# EAGLE design ESP-32-UNICLOCK-Z560M-V2 (EAGLE 6.3)
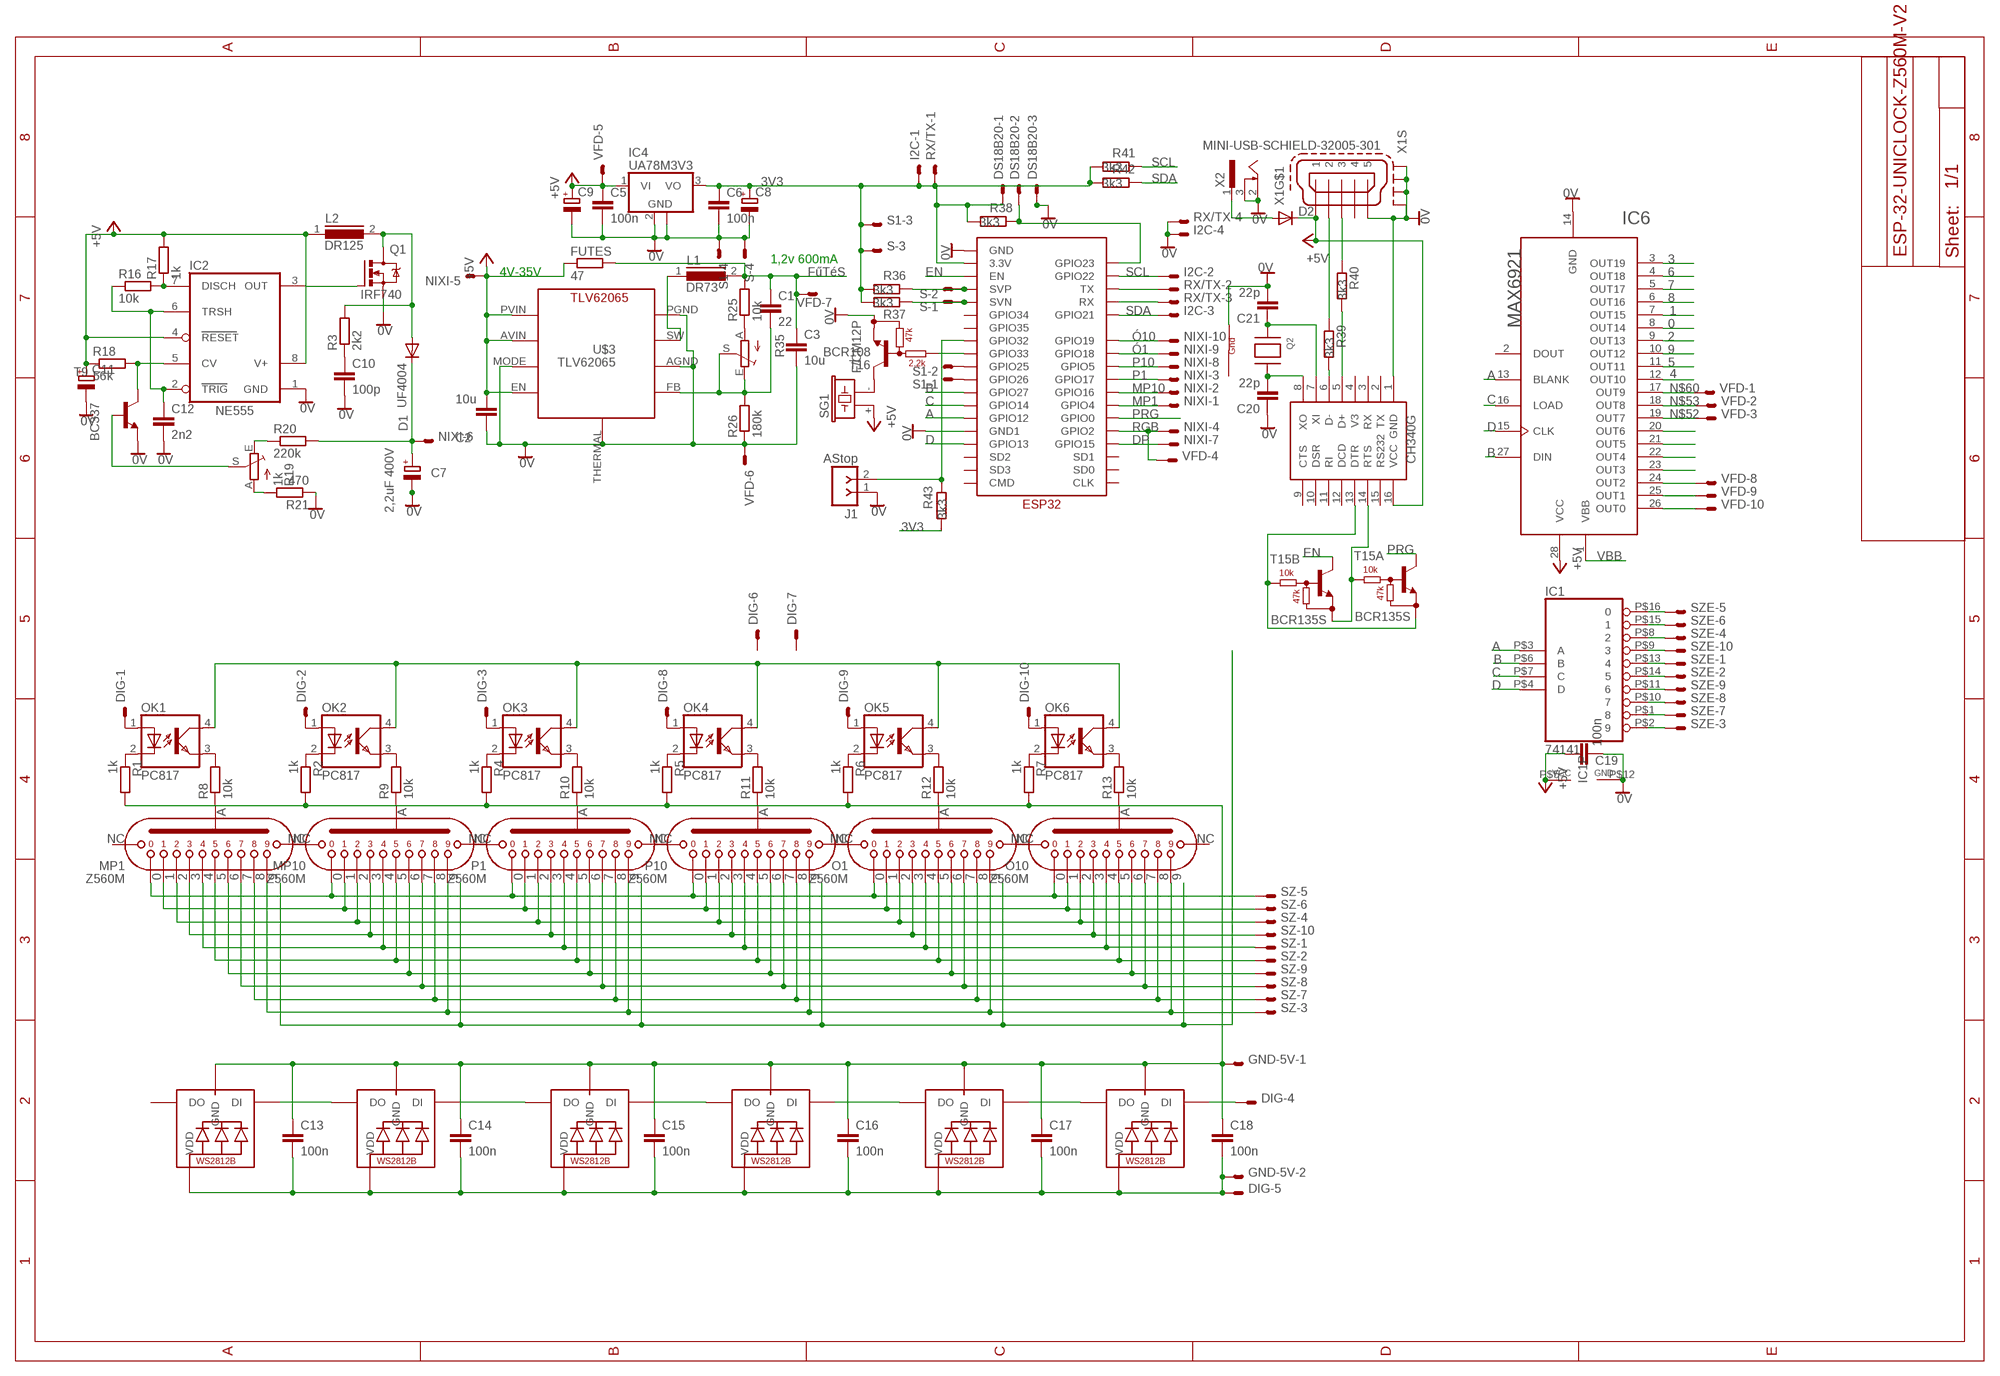
[diagram p0: schematic, sheet 1]

## Parts
C1  22  C0603  [0603]
C2  10u  C1206  [1206]
C3  10u  C1206  [1206]
C5  100n  C0603  [0603]
C6  100n  C0603  [0603]
C7  2,2uF 400V  CPOL-EUE2.5-7  [E2,5-7]
C8  CPOL-EUE2.5-5  [E2,5-5]
C9  CPOL-EUE2.5-5  [E2,5-5]
C10  100p  C-EU050-024X044  [C050-024X044]
C11  CPOL-EUE2.5-7  [E2,5-7]
C12  2n2  C-EUC0603  [C0603]
C13  100n  C-EUC0603  [C0603]
C14  100n  C-EUC0603  [C0603]
C15  100n  C-EUC0603  [C0603]
C16  100n  C-EUC0603  [C0603]
C17  100n  C-EUC0603  [C0603]
C18  100n  C-EUC0603  [C0603]
C19  100n  C0603  [0603]
C20  22p  C0603  [0603]
C21  22p  C0603  [0603]
D1  UF4004  BA221  [DO35-10]
D2  DIODE-SOD123  [SOD123]
DIG  DIG  PAD10  [PAD10]
DS18B20  PAD3  [PAD3]
FUTES  47  R-EU_0207/10  [0207/10]
GND-5V  PAD2  [PAD2]
I2C  PAD4  [PAD4]
IC1  74141  [DIL16SMD]
IC2  NE555  ICM7555  [DIL08]
IC4  UA78M3V3  UA78M05DCY  [SOT223]
IC6  MAX6921  MAX6921SOIC28W  [SO-28W]
J1  AStop  F-1X02-SIP-100-32  [SIP-100-02-32]
L1  DR73  [DR73]
L2  DR125  [DR125]
LED1  WS2812B_5050N  [WS2812B-NARROW]
LED2  WS2812B_5050N  [WS2812B-NARROW]
LED3  WS2812B_5050N  [WS2812B-NARROW]
LED4  WS2812B_5050N  [WS2812B-NARROW]
LED5  WS2812B_5050N  [WS2812B-NARROW]
LED6  WS2812B_5050N  [WS2812B-NARROW]
MP1  Z560M  [Z560M]
MP10  Z560M  [Z560M]
NIXI  PAD10  [PAD10]
O1  Z560M  [Z560M]
O10  Z560M  [Z560M]
OK1  PC817  [DIL04]
OK2  PC817  [DIL04]
OK3  PC817  [DIL04]
OK4  PC817  [DIL04]
OK5  PC817  [DIL04]
OK6  PC817  [DIL04]
P1  Z560M  [Z560M]
P10  Z560M  [Z560M]
Q1  IRF740  [TO220BV]
Q2  XTAL-4-3225  [NX3225]
R1  1k  R0603  [0603]
R2  1k  R0603  [0603]
R3  2k2  R-EU_0204/7  [0204/7]
R4  1k  R0603  [0603]
R5  1k  R0603  [0603]
R6  1k  R0603  [0603]
R7  1k  R0603  [0603]
R8  10k  R-EU_0207/10  [0207/10]
R9  10k  R-EU_0207/10  [0207/10]
R10  10k  R-EU_0207/10  [0207/10]
R11  10k  R-EU_0207/10  [0207/10]
R12  10k  R-EU_0207/10  [0207/10]
R13  10k  R-EU_0207/10  [0207/10]
R16  10k  R-EU_R0603  [R0603]
R17  1k  R-EU_R0603  [R0603]
R18  56k  R-EU_R0603  [R0603]
R19  1k  TRIM_EU-CA6H  [CA6H]
R20  220k  R-EU_0204/7  [0204/7]
R21  470  R-EU_0204/7  [0204/7]
R25  10k  R0603  [0603]
R26  180k  R0603  [0603]
R35  TRIM_EU-B25P  [B25P]
R36  3k3  R0603  [0603]
R37  3k3  R0603  [0603]
R38  3k3  R0603  [0603]
R39  3k3  R0603  [0603]
R40  3k3  R0603  [0603]
R41  3k3  R0603  [0603]
R42  3k3  R0603  [0603]
R43  3k3  R0603  [0603]
RX/TX  PAD4  [PAD4]
S  PAD4  [PAD4]
S1  PAD4  [PAD4]
SG1  F/CM12P  [F/CM12P]
SZ  PAD10  [PAD10]
SZE  PAD10  [PAD10]
T9  BC337  BC237-NPN-TO92-CBE  [TO92-CBE]
T15  BCR135S  [SOT363_INFINEON]
T16  BCR108  [SOT23-BEC]
U$1  CH340G  [SOIC16]
U$2  ESP32-2X18  [ESP322X18]
U$3  TLV62065  [TLV62065]
VFD  PAD10  [PAD10]
X1  MINI-USB-SCHIELD-32005-301  [32005-301]
X2  733989-5  [733989-5]

## Nets
0: IC1.P$16 IC6.8(OUT14) SZE.P$5
0V: C2.2 C3.2 C5.2 C6.2 C7.- C8.- C9.- C10.2 C11.- C12.2 C19.2 C20.1 C21.2 DS18B20.P$3 I2C.P$4 IC1.P$12(GND) IC2.1(GND) IC4.2(GND) IC4.4(GND) IC6.14(GND) J1.1 Q1.S Q2.4(G1) R21.1 R26.1 RX/TX.P$4 S1.P$4 S.P$4 T9.E T16.E U$1.1(GND) U$2.P$19(GND) U$2.P$26(GND1) U$3.AGND U$3.MODE U$3.PGND U$3.THERMAL VFD.P$6 X1.5 X1.M1(S:S1) X1.M2(S:S2) X1.M3(S:S3) X1.M4(S:S4) X2.2 X2.3
1: IC1.P$15 IC6.7(OUT15) SZE.P$6
2: IC1.P$8 IC6.9(OUT13) SZE.P$4
3: IC1.P$9 IC6.3(OUT19) SZE.P$10
3V3: C6.1 C8.+ DS18B20.P$1 I2C.P$1 IC4.3(VO) R36.2 R37.2 R38.2 R41.2 R42.2 R43.2 RX/TX.P$1 S1.P$3 S.P$3 U$2.P$20(3.3V)
4: IC1.P$13 IC6.12(OUT10) SZE.P$1
5: IC1.P$14 IC6.11(OUT11) SZE.P$2
6: IC1.P$11 IC6.4(OUT18) SZE.P$9
7: IC1.P$10 IC6.5(OUT17) SZE.P$8
8: IC1.P$1 IC6.6(OUT16) SZE.P$7
9: IC1.P$2 IC6.10(OUT12) SZE.P$3
+5V: C2.1 C5.1 C9.+ C11.+ C19.1 D2.C FUTES.1 IC1.P$5(VCC) IC2.4(RESET) IC2.8(V+) IC4.1(VI) IC6.28(VCC) L2.1 NIXI.P$5 R17.2 R18.1 SG1.+ U$1.16(VCC) U$3.AVIN U$3.EN U$3.PVIN VFD.P$5 X1.1
A: IC1.P$3(A) IC6.13(BLANK) U$2.P$12(GPIO12)
B: IC1.P$6(B) IC6.27(DIN) U$2.P$10(GPIO27)
C: IC1.P$7(C) IC6.16(LOAD) U$2.P$9(GPIO14)
D: IC1.P$4(D) IC6.15(CLK) U$2.P$11(GPIO13)
DP: NIXI.P$7 U$2.P$35(GPIO15)
EN: T15.3(B:C) U$2.P$21(EN)
FűTéS: C1.1 C3.1 FUTES.2 L1.2 R25.2 VFD.P$7
GND: C13.1 C14.1 C15.1 C16.1 C17.1 C18.1 GND-5V.P$1 LED1.3-GND(GND) LED2.3-GND(GND) LED3.3-GND(GND) LED4.3-GND(GND) LED5.3-GND(GND) LED6.3-GND(GND) R1.2 R2.2 R4.2 R5.2 R6.2 R7.2
K0: MP1.P3 MP10.P3 O1.P3 O10.P3 P1.P3 P10.P3 SZ.P$5
K1: MP1.P13 MP10.P13 O1.P13 O10.P13 P1.P13 P10.P13 SZ.P$6
K2: MP1.P12 MP10.P12 O1.P12 O10.P12 P1.P12 P10.P12 SZ.P$4
K3: MP1.P11 MP10.P11 O1.P11 O10.P11 P1.P11 P10.P11 SZ.P$10
K4: MP1.P10 MP10.P10 O1.P10 O10.P10 P1.P10 P10.P10 SZ.P$1
K5: MP1.P9 MP10.P9 O1.P9 O10.P9 P1.P9 P10.P9 SZ.P$2
K6: MP1.P7 MP10.P7 O1.P7 O10.P7 P1.P7 P10.P7 SZ.P$9
K7: MP1.P6 MP10.P6 O1.P6 O10.P6 P1.P6 P10.P6 SZ.P$8
K8: MP1.P5 MP10.P5 O1.P5 O10.P5 P1.P5 P10.P5 SZ.P$7
K9: MP1.P4 MP10.P4 O1.P4 O10.P4 P1.P4 P10.P4 SZ.P$3
MP1: NIXI.P$1 U$2.P$34(GPIO4)
MP10: NIXI.P$2 U$2.P$31(GPIO16)
N$1: T15.1(A:E) T15.5(B:B) U$1.13(DTR)
N$2: S1.P$1 U$2.P$7(GPIO26)
N$3: IC6.26(OUT0) VFD.P$10
N$4: IC6.25(OUT1) VFD.P$9
N$6: L1.1 U$3.SW
N$7: OK1.2(C) R1.1
N$8: IC6.24(OUT2) VFD.P$8
N$10: OK2.2(C) R2.1
N$11: OK3.2(C) R4.1
N$12: OK6.2(C) R7.1
N$13: DIG.P$10 OK6.1(A)
N$14: DIG.P$3 OK3.1(A)
N$15: OK1.4(COL) OK2.4(COL) OK3.4(COL) OK4.4(COL) OK5.4(COL) OK6.4(COL)
N$16: DIG.P$1 OK1.1(A)
N$17: OK4.2(C) R5.1
N$18: R19.E R20.1
N$19: DIG.P$8 OK4.1(A)
N$20: R19.A R21.2
N$21: OK5.2(C) R6.1
N$22: IC2.3(OUT) Q1.G
N$23: IC2.7(DISCH) R16.2 R17.1
N$24: C12.1 IC2.2(TRIG) IC2.6(TRSH) R16.1
N$25: DIG.P$9 OK5.1(A)
N$26: IC2.5(CV) R18.2 T9.C
N$27: C10.1 R3.1
N$28: R37.1 S.P$1 U$2.P$1(SVN)
N$29: DIG.P$2 OK2.1(A)
N$30: MP1.P2(A) R8.1
N$31: MP10.P2(A) R9.1
N$32: P1.P2(A) R10.1
N$33: P10.P2(A) R11.1
N$34: O1.P2(A) R12.1
N$35: O10.P2(A) R13.1
N$36: OK6.3(EMIT) R13.2
N$37: OK5.3(EMIT) R12.2
N$38: OK4.3(EMIT) R11.2
N$39: OK3.3(EMIT) R10.2
N$40: OK2.3(EMIT) R9.2
N$41: OK1.3(EMIT) R8.2
N$43: IC6.23(OUT3)
N$44: D1.A L2.2 Q1.D R3.2
N$46: DS18B20.P$2 R38.1 U$2.P$23(GPIO23)
N$49: IC6.22(OUT4)
N$50: IC6.21(OUT5)
N$51: IC6.20(OUT6)
N$52: IC6.19(OUT7) VFD.P$3
N$53: IC6.18(OUT8) VFD.P$2
N$54: LED1.2-DOUT(DO) LED2.4-DIN(DI)
N$55: LED2.2-DOUT(DO) LED3.4-DIN(DI)
N$60: IC6.17(OUT9) VFD.P$1
N$65: LED3.2-DOUT(DO) LED4.4-DIN(DI)
N$66: LED4.2-DOUT(DO) LED5.4-DIN(DI)
N$70: D2.A X2.1
N$71: DIG.P$4 LED1.4-DIN(DI)
N$72: R36.1 S.P$2 U$2.P$2(SVP)
N$73: S1.P$2 U$2.P$8(GPIO25)
N$74: R39.1 X1.2
N$75: R40.2 U$1.5(D+)
N$76: R39.2 U$1.6(D-)
N$77: R40.1 X1.3
N$78: LED5.2-DOUT(DO) LED6.4-DIN(DI)
N$79: T15.2(A:B) T15.4(B:E) U$1.14(RTS)
N$80: C20.2 Q2.3(X2) U$1.8(XO)
N$81: C13.2 C14.2 C15.2 C16.2 C17.2 C18.2 DIG.P$5 GND-5V.P$2 LED1.1-VDD(VDD) LED2.1-VDD(VDD) LED3.1-VDD(VDD) LED4.1-VDD(VDD) LED5.1-VDD(VDD) LED6.1-VDD(VDD)
N$89: C21.1 Q2.1(X1) U$1.7(XI)
N$92: RX/TX.P$2 U$2.P$22(TX)
N$93: RX/TX.P$3 U$2.P$24(RX)
N$94: SG1.- T16.C
N$95: T16.B U$2.P$5(GPIO33)
N$96: J1.2 R43.1 U$2.P$6(GPIO32)
N$98: R25.1 R35.A
N$99: C1.2 R26.2 R35.E R35.S U$3.FB
N$119: R19.S T9.B
P1: NIXI.P$3 U$2.P$32(GPIO17)
P10: NIXI.P$8 U$2.P$29(GPIO5)
PRG: T15.6(A:C) U$2.P$33(GPIO0)
RGB: NIXI.P$4 U$2.P$36(GPIO2) VFD.P$4
SCL: I2C.P$2 R41.1 U$2.P$25(GPIO22)
SDA: I2C.P$3 R42.1 U$2.P$28(GPIO21)
VBB: C7.+ D1.C IC6.1(VBB) NIXI.P$6 R20.2
Ó1: NIXI.P$9 U$2.P$30(GPIO18)
Ó10: NIXI.P$10 U$2.P$27(GPIO19)
Unconnected: DIG.P$6 DIG.P$7 IC6.2(DOUT) LED6.2-DOUT(DO) MP1.P1(NC1) MP1.P8(NC2) MP10.P1(NC1) MP10.P8(NC2) O1.P1(NC1) O1.P8(NC2) O10.P1(NC1) O10.P8(NC2) P1.P1(NC1) P1.P8(NC2) P10.P1(NC1) P10.P8(NC2) U$1.2(TX) U$1.3(RX) U$1.4(V3) U$1.9(CTS) U$1.10(DSR) U$1.11(RI) U$1.12(DCD) U$1.15(RS232) U$2.P$3(GPIO35) U$2.P$4(GPIO34) U$2.P$13(SD3) U$2.P$14(SD2) U$2.P$15(CLK) U$2.P$16(CMD) U$2.P$17(SD1) U$2.P$18(SD0) X1.4

## Notes on the sheet
- 1,2v 600mA
- 4V-35V

## Power pins joined to a net without a drawn wire
G2: Q2.2(G2)

## Library data of the parts
C1-C3 C5 C6 C19-C21 =  Zozo:C
C7-C9 C11 = resistor:CPOL-EU: POLARIZED CAPACITOR, European symbol
C10 C12-C18 = resistor:C-EU: CAPACITOR, European symbol
D1 = diode:BA221: DIODE high speed (Philips)
D2 = diode:DIODE-: DIODE
DIG NIXI SZ SZE VFD = tuskesor:PAD10
DS18B20 = tuskesor:PAD3
FUTES R3 R8-R13 R16-R18 R20 R21 = resistor:R-EU_: RESISTOR, European symbol
GND-5V = tuskesor:PAD2
I2C RX/TX S S1 = tuskesor:PAD4
IC1 = 74xx-eu:74*141: BCD to decimal DECODER/DRIVER
IC2 = maxim1:ICM7555: TIMER; MF: MAXIM; MPN: ICM7555IPA+; OC_FARNELL: 9663762; OC_NEWARK: 68K4387
IC4 = linear:UA78M*: POSITIVE-VOLTAGE REGULATORS Source: http://focus.ti.com/lit/ds/symlink/ua78m33.pdf
IC6 = JVN:MAX6921
J1 = con-headers-jp:F-1X02-: FEMALE HEADER
L1 = inductors:DR73: High Power Density, High Efficiency, Shielded Inductors Source: coiltronics_dr_series.pdf
L2 = inductors:DR125: High Power Density, High Efficiency, Shielded Inductors Source: coiltronics_dr_series.pdf
LED1-LED6 = adafruit:WS2812B
MP1 MP10 O1 O10 P1 P10 =    nixietubes-western:Z560M
OK1-OK6 = optocoupler:PC817: SHARP OPTO COUPLER; MPN: PC817X4J000F; OC_FARNELL: 9707727; OC_NEWARK: 97K7059
Q1 = transistor-power:IRF740: N-CHANNEL MOS FET
Q2 = adafruit:XTAL-4: Classic 4-pin 3.2 x 2.5mm crystal
R1 R2 R4-R7 R25 R26 R36-R43 =  Zozo:R
R19 R35 = pot:TRIM_EU-: POTENTIOMETER
SG1 = buzzer:F/CM12P: BUZZER Source: Buerklin; OC_FARNELL: unknown; OC_NEWARK: unknown
T9 = transistor:*-NPN-: NPN Transistror BF959 corrected 2008.03.06
T15 = digital-transistors-1:BCR135S: Dual NPN Silicon Digital Transistor 50V 0,1A 0,25W
T16 = digital-transistors:BCR108: NPN Silicon Digital Transistor 50V 0,1A 0,2W
U$1 = ch340g:CH340G
U$2 = ESP32:ESP32-2X18
U$3 = LMR23630:TLV62065
X1 = con-cypressindustries:MINI-USB-SCHIELD-: MINI USB-B Conector Source: www.cypressindustries.com; OC_FARNELL: unknown; OC_NEWARK: unknown
X2 = con-conrad:73398?: FEMALE PRINT CONNECTOR Niedervolt-Steckverbinder Distributor Conrad

## Board
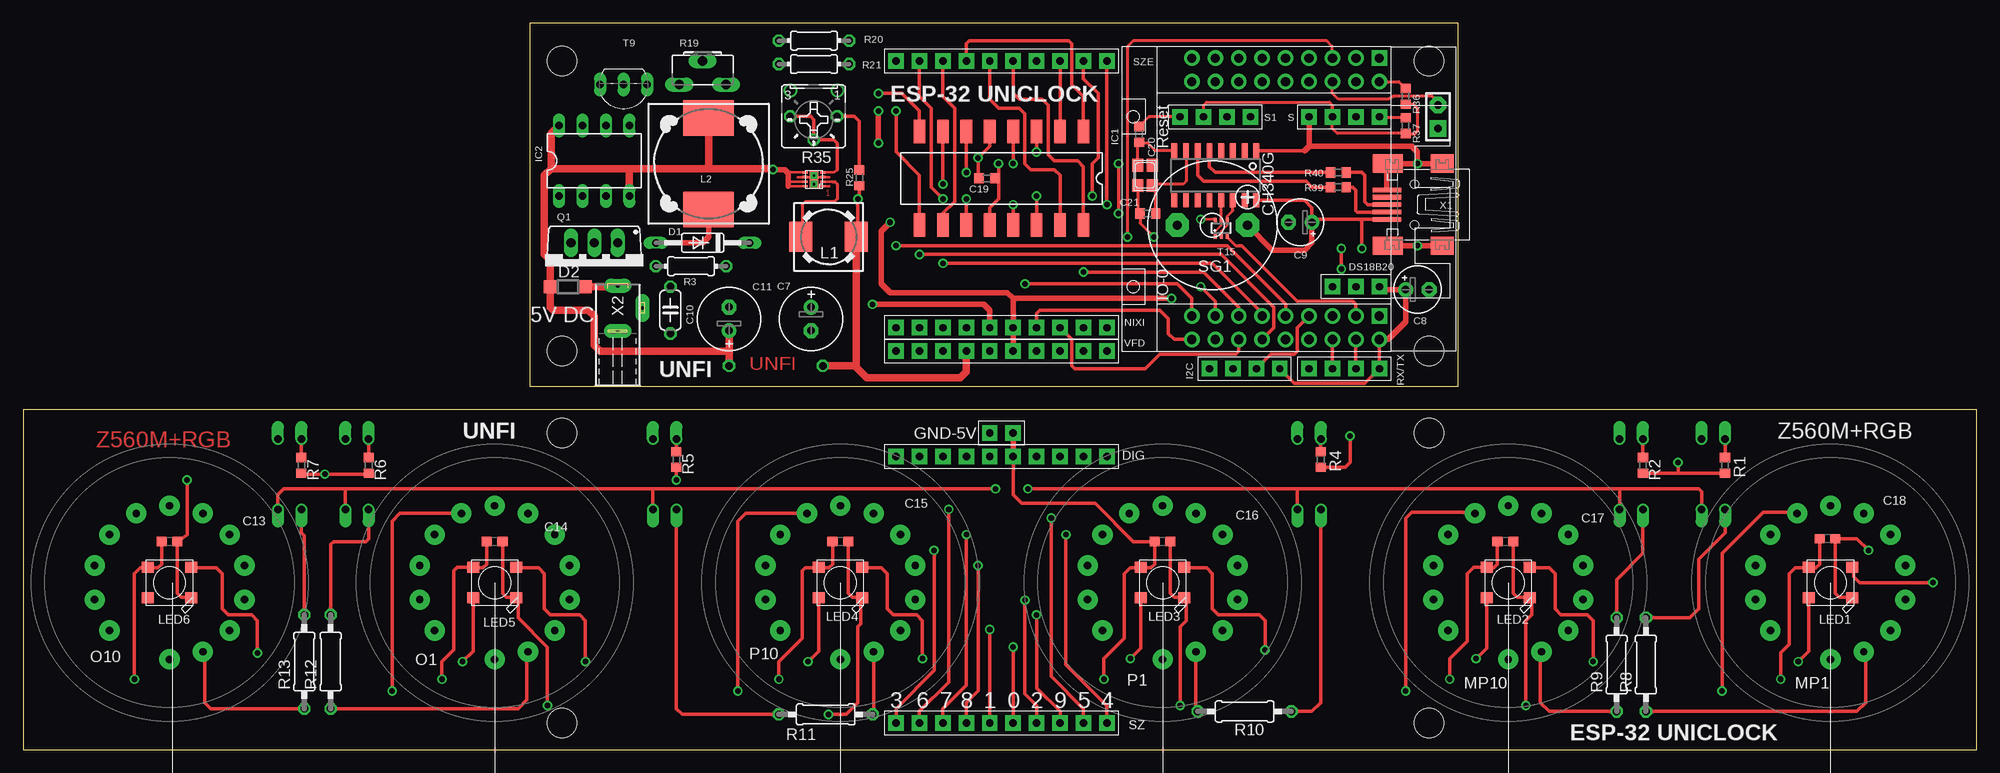
[diagram p1: board, top side]
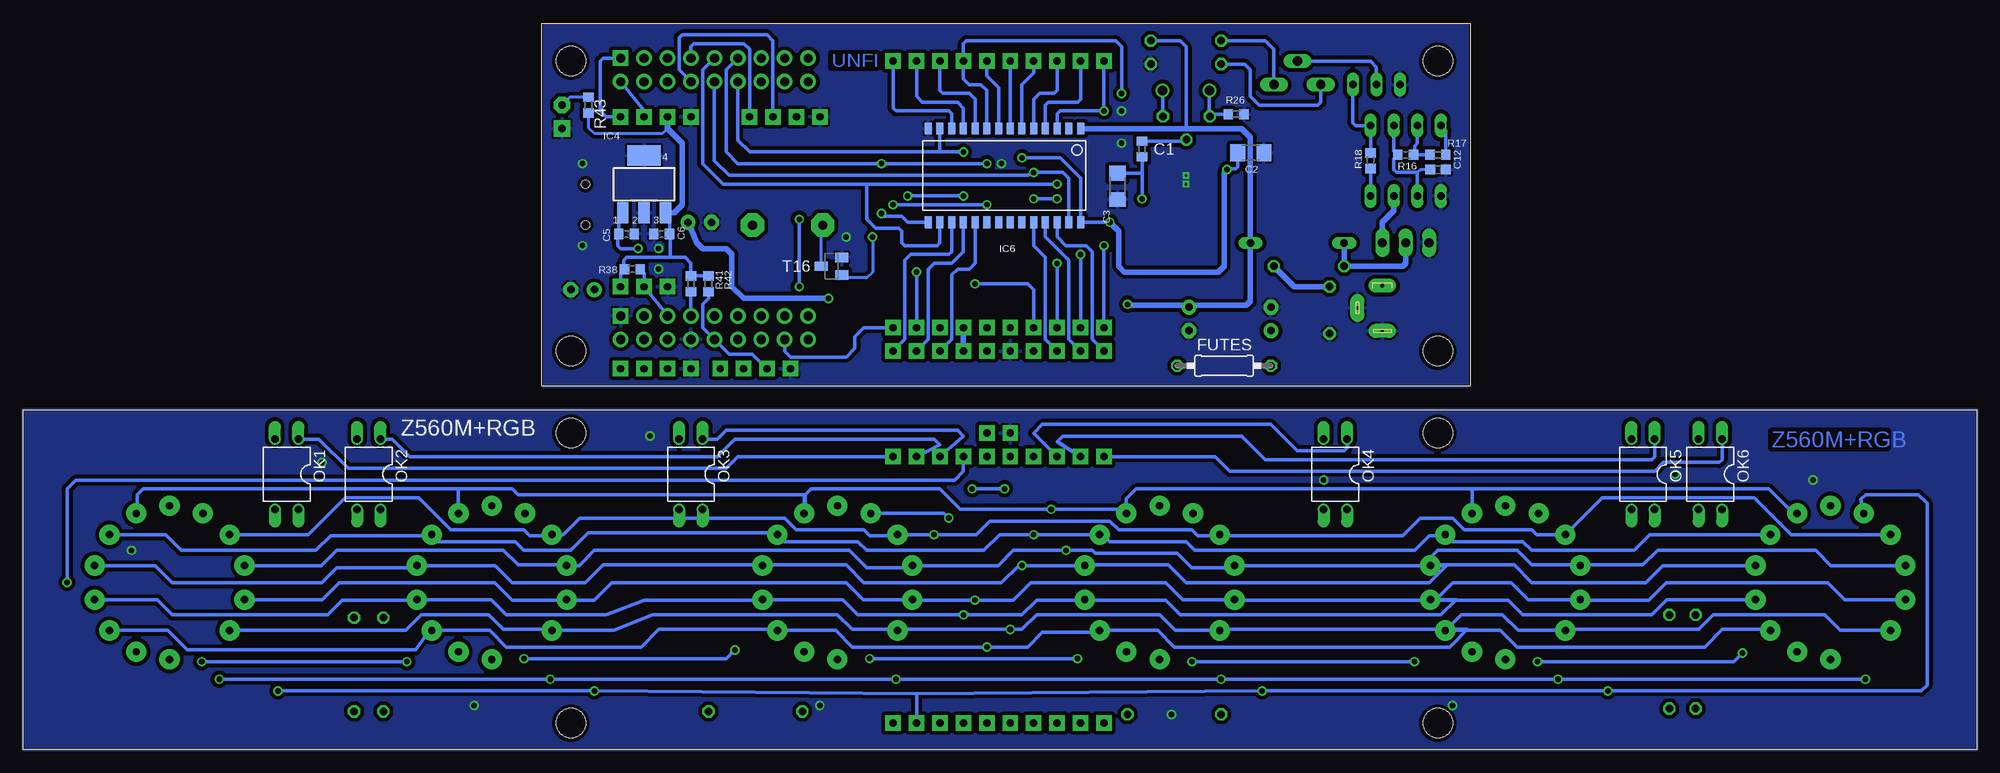
[diagram p2: board, bottom side, seen from below]

Size 211.77 x 78.74 mm. Coordinates in mm from the lower left corner, seen from the top.
Outline: 0,0 211.77,0 211.77,36.83 0,36.83 0,0
Outline: 54.93,39.37 155.57,39.37 155.57,78.74 54.93,78.74 54.93,39.37
Copper layers (1*16): Top 0.035mm / dielectric 1.5mm / Bottom 0.035mm
Design rules "default *": minimum track width 10mil, minimum drill 24mil, track to track 8mil, track to pad 8mil, pad to pad 8mil, via to via 8mil, smd to smd 8mil, copper to edge 0mil, drill to drill 8mil, minimum pad ring 10mil, minimum via ring 8mil, stop-mask expansion 4mil, vias tented up to drill 0mil, thermal gap 10mil
Holes 3.2 mm at 58.42,74.61 58.42,43.18 152.4,43.18 152.4,74.61 152.4,34.29 58.42,34.29 58.42,2.86 152.4,2.86

### Footprints (pad centres in the part's own frame; a part is rotated, then mirrored left to right if it is on the bottom)
0603 = smd 1 x 1.1: 1 -0.85,0; 2 0.85,0
1206 = smd 1.6 x 1.803: 1 -1.422,0; 2 1.422,0
E2,5-7 = drill 0.813 pad 1.6: + -1.27,0 | drill 0.813 pad 1.6 octagon: - 1.27,0
E2,5-5 = drill 0.813 pad 1.6: + -1.27,0 | drill 0.813 pad 1.6 octagon: - 1.27,0
C050-024X044 = drill 0.813 octagon: 1 -2.54,0; 2 2.54,0
C0603 = smd 1.1 x 1: 1 -0.85,0; 2 0.85,0
DO35-10 = drill 0.813 long: A 5.08,0; C -5.08,0
SOD123 = smd 1.4 x 1.4: A 1.9,0; C -1.9,0
PAD10 = drill 0.8 pad 1.676 square: P$1 0,0; P$2 2.54,0; P$3 5.08,0; P$4 7.62,0; P$5 10.16,0; P$6 12.7,0; P$7 15.24,0; P$8 17.78,0; P$9 20.32,0; P$10 22.86,0
PAD3 = drill 0.8 pad 1.676 square: P$1 0,0; P$2 2.54,0; P$3 5.08,0
0207/10 = drill 0.813 octagon: 1 -5.08,0; 2 5.08,0
PAD2 = drill 0.8 pad 1.676 square: P$1 0,0; P$2 2.54,0
PAD4 = drill 0.8 pad 1.676 square: P$1 0,0; P$2 2.54,0; P$3 5.08,0; P$4 7.62,0
DIL16SMD = smd 1.27 x 2.54: P$1 0,0; P$2 2.54,0; P$3 5.08,0; P$4 7.62,0; P$5 10.16,0; P$6 12.7,0; P$7 15.24,0; P$8 17.78,0; P$9 17.78,10.16; P$10 15.24,10.16; P$11 12.7,10.16; P$12 10.16,10.16; P$13 7.62,10.16; P$14 5.08,10.16; P$15 2.54,10.16; P$16 0,10.16
DIL08 = drill 0.813 long: 1 -3.81,-3.81; 2 -1.27,-3.81; 3 1.27,-3.81; 4 3.81,-3.81; 5 3.81,3.81; 6 1.27,3.81; 7 -1.27,3.81; 8 -3.81,3.81
SOT223 = smd 1.219 x 2.235: 1 -2.311,-3.099; 2 0,-3.099; 3 2.311,-3.099 | smd 3.6 x 2.2: 4 0,3.099
SO-28W = smd 0.762 x 1.27: 1 -8.255,-5.08; 2 -6.985,-5.08; 3 -5.715,-5.08; 4 -4.445,-5.08; 5 -3.175,-5.08; 6 -1.905,-5.08; 7 -0.635,-5.08; 8 0.635,-5.08; 9 1.905,-5.08; 10 3.175,-5.08; 11 4.445,-5.08; 12 5.715,-5.08; 13 6.985,-5.08; 14 8.255,-5.08; 15 8.255,5.08; 16 6.985,5.08; 17 5.715,5.08; 18 4.445,5.08; 19 3.175,5.08; 20 1.905,5.08; 21 0.635,5.08; 22 -0.635,5.08; 23 -1.905,5.08; 24 -3.175,5.08; 25 -4.445,5.08; 26 -5.715,5.08; 27 -6.985,5.08; 28 -8.255,5.08
SIP-100-02-32 = drill 0.813 pad 1.778 square: 1 -1.27,0 | drill 0.813 pad 1.778 octagon: 2 1.27,0
DR73 = smd 2.5 x 3.25: 1 -3,0; 2 3,0
DR125 = smd 3.85 x 5.5: 1 -4.975,0; 2 4.975,0
WS2812B-NARROW = smd 1.3 x 1.2: 1-VDD 2.35,-1.65; 2-DOUT 2.35,1.65; 3-GND -2.35,1.65; 4-DIN -2.35,-1.65
Z560M = drill 0.8 pad 2.184: P1 0,-8.325; P2 3.61,-7.5; P3 6.51,-5.19; P4 8.12,-1.85; P5 8.12,1.85; P6 6.51,5.19; P7 3.61,7.5; P8 0,8.325; P9 -3.61,7.5; P10 -6.51,5.19; P11 -8.12,1.85; P12 -8.12,-1.85; P13 -6.51,-5.19
DIL04 = drill 0.813 offset: 1 -1.27,-3.81; 2 1.27,-3.81; 3 1.27,3.81; 4 -1.27,3.81
TO220BV = drill 1.016 long: D 0,-2.54; G -2.54,-2.54; S 2.54,-2.54
NX3225 = smd 1.4 x 1.2: 1 -1.1,-0.8; 2 1.1,-0.8; 3 1.1,0.8; 4 -1.1,0.8
0204/7 = drill 0.813 octagon: 1 -3.81,0; 2 3.81,0
R0603 = smd 1 x 1.1: 1 -0.85,0; 2 0.85,0
CA6H = drill 1.016 long: A -2.54,0; E 2.54,0; S 0,2.54
B25P = drill 0.813 octagon: A -2.54,0; E 2.54,0; S 0,2.54
F/CM12P = drill 1.016 pad 2.54 octagon: + 3.81,0; - -3.81,0
TO92-CBE = drill 0.813 long: B 0,0; C -2.54,0; E 2.54,0
SOT363_INFINEON = smd 0.3 x 0.7: 1 -0.65,-0.8; 2 0,-0.8; 3 0.65,-0.8; 4 0.65,0.8; 5 0,0.8; 6 -0.65,0.8
SOT23-BEC = smd 1 x 1.4: B -0.95,-1.1; C 0,1.1; E 0.95,-1.1
SOIC16 = smd 0.635 x 1.524: 1 -4.445,-2.695; 2 -3.175,-2.695; 3 -1.905,-2.695; 4 -0.635,-2.695; 5 0.635,-2.695; 6 1.905,-2.695; 7 3.175,-2.695; 8 4.445,-2.695; 9 4.445,2.695; 10 3.175,2.695; 11 1.905,2.695; 12 0.635,2.695; 13 -0.635,2.695; 14 -1.905,2.695; 15 -3.175,2.695; 16 -4.445,2.695
ESP322X18 = drill 1 pad 1.676 square: P$1 0,0; P$19 27.94,0 | drill 1 pad 1.676: P$2 2.54,0; P$3 0,-2.54; P$4 2.54,-2.54; P$5 0,-5.08; P$6 2.54,-5.08; P$7 0,-7.62; P$8 2.54,-7.62; P$9 0,-10.16; P$10 2.54,-10.16; P$11 0,-12.7; P$12 2.54,-12.7; P$13 0,-15.24; P$14 2.54,-15.24; P$15 0,-17.78; P$16 2.54,-17.78; P$17 0,-20.32; P$18 2.54,-20.32; P$20 30.48,0; P$21 27.94,-2.54; P$22 30.48,-2.54; P$23 27.94,-5.08; P$24 30.48,-5.08; P$25 27.94,-7.62; P$26 30.48,-7.62; P$27 27.94,-10.16; P$28 30.48,-10.16; P$29 27.94,-12.7; P$30 30.48,-12.7; P$31 27.94,-15.24; P$32 30.48,-15.24; P$33 27.94,-17.78; P$34 30.48,-17.78; P$35 27.94,-20.32; P$36 30.48,-20.32
TLV62065 = smd 0.5 x 0.25: AGND 0,0.5; AVIN 1.9,1; EN 1.9,0; FB 0,0; MODE 1.9,0.5; PGND 0,1.5; PVIN 1.9,1.5; SW 0,1 | smd 0.9 x 1.9: THERMAL 0.96,0.76
32005-301 = smd 3.1 x 0.5: 1 3,1.6; 2 3,0.8; 3 3,0; 4 3,-0.8; 5 3,-1.6 | smd 2.5 x 2: M1 -3,-4.45; M2 -3,4.45 | smd 3.3 x 2: M3 2.9,4.45; M4 2.9,-4.45 | hole 0.9: 0,2.2; 0,-2.2
733989-5 = drill 0.4 pad 1.5 long: 1 0,5.82; 3 2.7,3.42 | drill 0.3 pad 1.5 long: 2 0,0.92

### Placement (x,y rotation side)
C1  90.49,65.09 90 bottom
C2  78.7,64.69 0 bottom
C3  93.13,61.04 270 bottom
C5  146.37,55.88 0 bottom
C6  142.56,55.88 180 bottom
C7  85.41,46.67 270 top
C8  151.13,49.85 0 top
C9  138.43,57.15 180 top
C10  70.17,47.62 270 top
C11  76.52,46.67 90 top
C12  58.42,62.86 0 bottom
C13  15.88,22.54 180 top
C14  51.12,22.54 180 top
C15  88.58,22.54 180 top
C16  123.51,22.54 180 top
C17  160.66,22.54 180 top
C18  195.58,22.86 180 top
C19  104.46,61.91 0 top
C20  120.97,66.67 270 top
C21  121.92,58.1 180 top
D1  73.66,54.93 180 top
D2  59.05,50.16 0 top
DIG  117.47,31.75 180 top
DS18B20  147,50.16 180 top
FUTES  81.6,41.59 180 bottom
GND-5V  104.78,34.29 0 top
I2C  136.21,41.27 180 top
IC1  114.94,66.99 180 top
IC2  61.91,63.82 0 top
IC4  144.46,61.28 0 bottom
IC6  105.41,62.23 180 bottom
J1  153.35,68.58 90 top
L1  87.31,55.56 0 top
L2  74.3,63.5 270 top
LED1  195.9,18.1 180 top
LED2  160.97,18.1 180 top
LED3  123.51,18.1 180 top
LED4  88.58,18.1 180 top
LED5  51.12,18.1 180 top
LED6  15.88,18.1 180 top
MP1  195.9,18.1 0 top
MP10  160.97,18.1 0 top
NIXI  117.47,45.72 180 top
O1  51.12,18.1 0 top
O10  15.88,18.1 0 top
OK1  183.2,29.84 180 bottom
OK2  174.31,29.84 180 bottom
OK3  139.38,29.84 180 bottom
OK4  69.53,29.84 180 bottom
OK5  36.19,29.84 180 bottom
OK6  28.89,29.84 180 bottom
P1  123.51,18.1 0 top
P10  88.58,18.1 0 top
Q1  61.91,52.39 180 top
Q2  121.6,62.23 90 top
R1  184.47,30.8 270 top
R2  175.58,30.8 270 top
R3  72.39,52.39 180 top
R4  140.65,31.43 270 top
R5  70.8,31.43 270 top
R6  37.46,30.8 270 top
R7  30.16,30.8 270 top
R8  175.9,9.21 90 top
R9  172.72,9.21 90 top
R10  132.4,4.13 0 top
R11  87,3.81 180 top
R12  33.34,9.53 90 top
R13  30.48,9.53 90 top
R16  61.91,64.45 0 bottom
R17  58.42,64.45 0 bottom
R18  65.72,63.82 90 bottom
R19  73.66,72.07 0 top
R20  85.72,76.84 0 top
R21  85.72,74.3 180 top
R25  90.65,61.95 270 top
R26  80.29,68.87 180 bottom
R35  85.69,68.64 180 top
R36  149.86,70.8 270 top
R37  149.86,67.63 270 top
R38  145.73,52.07 180 bottom
R39  142.56,60.96 180 top
R40  142.56,62.55 180 top
R41  139.38,50.48 90 bottom
R42  137.48,50.48 90 bottom
R43  150.5,69.85 270 bottom
RX/TX  147,41.27 180 top
S  147,68.58 180 top
S1  133.03,68.58 180 top
SG1  128.91,56.83 0 top
SZ  117.47,2.86 180 top
SZE  117.47,74.61 180 top
T9  65.09,72.07 180 top
T15  129.86,56.52 0 top
T16  124.14,52.39 90 bottom
U$1  129.22,62.23 180 top
U$2  147,74.93 270 top
U$3  86.68,62.55 180 top
VFD  117.47,43.18 180 top
X1  150.81,59.05 180 top
X2  64.45,44.45 0 top

### Tracks (layer width: path | path; a pad name or v marks a point on that pad's centre or on a via)
0
  Top 0.406: IC1.P$16 114.94,63.18 114.3,63.82 111.76,63.82 111.12,64.45 111.12,69.85 110.49,70.49 107.95,70.49 107.31,71.12 SZE.P$5
  Bottom 0.406: IC6.8 106.04,71.75 107.31,73.03 SZE.P$5
0V  (via drill 0.3, 0.6)
  Top 0.254: U$3.MODE 85.72,62.05 | U$3.AGND 85.72,62.05 | 85.72,62.05 U$3.THERMAL v85.72,62.23 | U$3.PGND 85.72,61.05 v85.72,61.28
  Top 0.305: S1.P$4 122.02,68.58 C20.1 | Q2.4 120.8,58.37 C21.2 121.07,57.05 v122.56,55.56
  Top 0.406: IC1.P$12 104.78,58.74 105.73,59.69 105.73,61.91 | 105.73,61.91 v105.73,63.5 | C19.2 105.73,61.91 | U$1.1 138.9,64.92 | v142.88,52.07 v142.88,54.29
  Top 0.61: v92.71,65.72 v92.71,69.21 | X1.M2 v151.13,54.6 v151.13,54.61 v151.12,54.6 X1.M3 | X1.M1 v151.13,63.5 | v151.13,63.5 v151.12,63.5 X1.M4 147.81,63.41 X1.5 | S.P$4 139.38,65.41 | 139.38,65.41 138.9,64.92 | 139.38,65.41 150.5,65.41 151.13,64.77 v151.13,63.5
  pour Bottom (isolate 0.406): 55.24,39.37 155.26,39.37 155.26,78.42 55.24,78.42
1
  Top 0.406: IC1.P$15 112.39,62.23 111.76,62.86 109.22,62.86 108.59,63.5 108.59,68.9 107.95,69.53 105.73,69.53 104.78,70.49 SZE.P$6
  Bottom 0.406: IC6.7 SZE.P$6
2  (via drill 0.6)
  Top 0.406: v92.71,71.12 95.25,71.12 97.16,69.21 IC1.P$8
  Bottom 0.406: IC6.9 107.31,71.44 107.95,72.07 109.22,72.07 109.85,72.71 SZE.P$4 109.85,76.52 109.54,76.84 93.34,76.84 92.71,76.2 v92.71,71.12
3  (via drill 0.6)
  Top 0.406: IC1.P$9 97.16,62.23 94.61,64.77 v94.61,69.21
  Bottom 0.406: IC6.3 99.69,68.9 99.38,69.21 v94.61,69.21 SZE.P$10
3V3
  Top 0.305: S1.P$3 127.95,69.85 128.27,70.17 141.6,70.17 141.92,69.85 | S.P$3 141.92,67.31 142.45,66.78 R37.2 149.96,66.67 150.81,66.67 151.13,66.99 151.13,69.53 150.71,69.95 R36.2
  Top 0.406: S.P$3 141.92,69.85 | U$2.P$20 RX/TX.P$1 145.41,39.69 137.79,39.69 I2C.P$1
  Top 0.61: U$2.P$20 147.95,44.45 149.86,46.35 C8.+ 147.64,49.85 DS18B20.P$1
  Bottom 0.305: R43.2 150.5,67.41 R37.2 142.45,66.78 142.08,67.15 142.08,68.42 S.P$3
  Bottom 0.406: IC4.3 141.71,57.74 C6.1 141.6,55.78 141.6,53.34 | DS18B20.P$1 147,51.65 R38.2 146.69,52.17 146.69,53.02 146.37,53.34 141.6,53.34 | R42.2 R41.2 139.38,52.71 140.02,53.34 141.6,53.34
  Bottom 0.61: IC4.3 141.21,58.18 140.34,59.06 140.34,65.72 141.92,67.31 S.P$3
4  (via drill 0.6)
  Top 0.406: IC1.P$13 v107.31,59.06 | v117.47,59.06 SZE.P$1
  Bottom 0.406: v107.31,59.06 v117.47,59.06 | IC6.12 111.12,68.9 111.44,69.21 117.16,69.21 117.47,69.53 SZE.P$1
5  (via drill 0.6)
  Top 0.406: IC1.P$14 v109.85,60.01 | v115.89,60.01 115.89,63.5 116.52,64.13 116.52,71.12 114.94,72.71 SZE.P$2
  Bottom 0.406: IC6.11 109.85,69.53 110.49,70.17 114.3,70.17 114.94,70.8 SZE.P$2 | v109.85,60.01 v115.89,60.01
6  (via drill 0.6)
  Top 0.406: SZE.P$9 97.16,70.8 98.42,69.53 98.42,60.96 v99.69,59.69 | IC1.P$11 v102.23,59.69
  Bottom 0.406: IC6.4 100.97,69.85 100.65,70.17 97.47,70.17 97.16,70.49 SZE.P$9 | v102.23,59.69 v99.69,59.69
7
  Top 0.406: IC1.P$10 99.69,58.1 100.97,59.37 100.97,69.53 99.69,70.8 SZE.P$8
  Bottom 0.406: IC6.5 102.23,70.49 101.6,71.12 100.01,71.12 99.69,71.44 SZE.P$8
8
  Top 0.406: SZE.P$7 102.23,76.52 102.55,76.84 113.35,76.84 113.66,76.52 113.66,72.07 114.94,70.8 IC1.P$1
  Bottom 0.406: IC6.6 103.5,72.07 102.23,73.34 SZE.P$7
9
  Top 0.406: SZE.P$3 IC1.P$2
  Bottom 0.406: IC6.10 108.59,70.49 109.22,71.12 112.08,71.12 112.39,71.44 SZE.P$3
+5V  (via drill 0.6)
  Top 0.254: U$3.EN 83.19,62.55 | 82.91,61.55 U$3.AVIN 83,61.55 82.95,61.6 | U$3.PVIN 82.95,61.05
  Top 0.305: 83.19,62.55 83.04,62.55 82.95,62.46
  Top 0.406: IC1.P$5 104.78,65.41 v103.5,64.13 103.5,62.02 C19.1 | U$1.16 138.9,59.53 139.7,58.74 C9.+ 140,57.46 145.1,57.46 | X1.1 145.1,57.46 | v145.1,54.29 145.1,57.46
  Top 0.61: v93.98,57.15 93.03,56.2 93.03,50.48 93.98,49.53 106.68,49.53 107.31,48.89 | 81.18,62.97 v81.28,62.86 82.55,62.86 82.95,62.46 82.95,61.6 82.95,61.05 | 107.31,48.89 v124.46,48.89 | 107.31,48.89 NIXI.P$5 VFD.P$5 | D2.C | SG1.+ 135.41,54.13 138.91,54.13 139.7,54.93 C9.+
  Top 0.813: 74.3,62.97 81.18,62.97 | L2.1 74.3,62.97 | R18.1 57.25,62.97 | IC2.4 R18.1 | R18.1 74.3,62.97 | 76.52,43.18 62.55,43.18 61.91,43.81 61.91,46.99 61.28,47.63 57.47,47.63 57.15,47.94 D2.C 57.15,53.02 56.52,53.66 56.52,62.23 57.25,62.97 | 76.52,43.18 C11.+ | FUTES.1 76.52,43.18 | 57.25,62.97 57.25,66.78 IC2.8
  Bottom 0.406: v93.98,57.15 IC6.28 97.16,61.91 99.38,64.13 v103.5,64.13 | R17.2 57.57,67.1 IC2.8 | R18.1 IC2.4 | IC4.1 147.22,57.74 C5.1 147.32,55.78 147.32,54.61 147,54.29 v145.1,54.29 | C2.1 80.12,63.18 80.33,62.97 81.18,62.97 v81.28,62.86
  Bottom 0.61: v93.98,57.15 93.03,56.2 93.03,52.39 92.39,51.75 82.23,51.75 81.6,52.39 81.6,62.55 v81.28,62.86 | v124.46,48.89 133.67,48.89 134.94,50.17 134.94,53.66 135.57,54.29 138.11,54.29 138.75,54.93 C9.+
A  (via drill 0.6)
  Top 0.406: IC1.P$3 v109.85,64.77
  Bottom 0.406: v109.85,64.77 112.39,64.77 | 112.39,64.77 133.03,64.77 134.3,66.04 U$2.P$12 | IC6.13 112.39,64.77
B  (via drill 0.6)
  Top 0.406: v102.23,62.55 IC1.P$6
  Bottom 0.406: IC6.27 98.42,61.91 99.06,62.55 v102.23,62.55 102.87,62.23 135.25,62.23 136.84,63.82 U$2.P$10
C  (via drill 0.6)
  Top 0.406: IC1.P$7 v99.69,61.28
  Bottom 0.406: 120.33,61.28 135.89,61.28 138.11,63.5 138.11,73.66 U$2.P$9 | IC6.16 112.39,54.93 112.71,54.61 116.2,54.61 116.52,54.93 116.52,56.2 116.84,56.52 119.38,56.52 120.33,57.47 120.33,61.28 | 120.33,61.28 v99.69,61.28
D  (via drill 0.6)
  Top 0.406: IC1.P$4 v107.31,63.5 | v118.75,58.1 v118.75,63.5
  Bottom 0.406: v107.31,63.5 v118.75,63.5 134.3,63.5 135.57,64.77 135.57,73.66 U$2.P$11 | IC6.15 115.89,57.15 116.52,57.78 118.43,57.78 v118.75,58.1
DP  (via drill 0.6)
  Top 0.406: v108.59,50.48 125.09,50.48 126.68,48.89 U$2.P$35
  Bottom 0.406: v108.59,50.48 102.87,50.48 102.23,49.85 NIXI.P$7
EN
  Top 0.305: T15.3 130.51,55.55 131.44,54.61 131.76,54.61
  Top 0.406: U$2.P$21 144.46,48.26 144.15,48.58 138.11,48.58 132.08,54.61 131.76,54.61
FűTéS  (via drill 0.6)
  Top 0.406: L1.2 90.49,55.74 v90.49,59.69 90.65,59.85 R25.2
  Top 0.813: VFD.P$7 102.23,40.96 101.6,40.32 91.44,40.32 90.31,41.45 90.31,41.59 | L1.2 90.31,41.59 | FUTES.2 90.31,41.59
  Bottom 0.406: C1.1 90.49,62.55 | 90.49,62.55 v90.49,59.69 | C3.1 90.57,62.46 90.49,62.55
GND  (via drill 0.6)
  Top 0.406: C17.1 161.5,16.93 161.93,16.51 163.26,16.51 LED2.3-GND 163.51,16.26 163.51,14.6 162.88,13.97 v162.88,4.76 | LED1.3-GND 198.19,16.51 196.85,16.51 196.43,16.93 C18.1 198.75,22.86 v200.03,21.59 | LED6.3-GND 18.48,16.51 17.14,16.51 16.72,16.93 C13.1 17.78,23.28 v17.78,29.21 | C14.1 51.97,16.93 52.39,16.51 53.4,16.51 LED5.3-GND 53.66,16.26 53.66,14.29 56.83,11.11 v56.83,4.76 | C15.1 89.43,16.93 89.85,16.51 90.87,16.51 LED4.3-GND 90.81,16.32 90.81,13.65 90.49,13.34 90.49,5.08 89.22,3.81 v87.31,3.81 | C16.1 124.36,16.93 124.78,16.51 125.79,16.51 LED3.3-GND 126.05,16.26 126.05,13.97 125.41,13.34 v125.41,4.76 | R7.2 30.26,29.85 v32.7,29.85 37.36,29.85 R6.2 | R5.2 v70.8,29.21 | R2.2 179.39,29.95 | 179.39,29.95 R1.2 | v179.39,31.12 179.39,29.95 | R4.2 143.29,30.58 143.83,31.12 v143.83,33.97
  pour Bottom (isolate 0.406): 0,0 211.77,0 211.77,36.83 0,36.83
K0  (via drill 0.6)
  Top 0.406: SZ.P$5 v107.31,11.11
  Bottom 0.406: O10.P3 22.81,13.02 27.62,13.02 29.53,11.11 49.85,11.11 51.64,12.91 O1.P3 57.74,13.02 55.24,13.02 57.15,11.11 87,11.11 88.79,12.91 P10.P3 95.3,12.7 101.28,12.7 102.87,11.11 v107.31,11.11 121.92,11.11 123.72,12.91 P1.P3 130.13,13.02 142.88,13.02 144.78,11.11 159.38,11.11 161.18,12.91 MP10.P3 167.59,13.02 167.64,13.02 169.23,10.79 193.99,10.79 196.11,12.91 MP1.P3
K1  (via drill 0.6)
  Top 0.406: SZ.P$6 v104.78,13.02
  Bottom 0.406: O10.P13 14.81,12.91 16.51,14.6 28.57,14.6 30.16,13.02 44.5,13.02 O1.P13 49.74,12.91 51.43,14.6 55.88,14.6 57.47,13.02 81.96,13.02 P10.P13 86.88,12.91 88.58,14.6 101.92,14.6 103.5,13.02 v104.78,13.02 116.89,13.02 P1.P13 117.11,13.02 121.92,13.02 123.51,14.6 143.51,14.6 147.75,12.91 MP10.P13 154.57,13.02 159.7,13.02 161.29,14.6 168.59,14.6 170.29,12.91 MP1.P13
K2  (via drill 0.6)
  Top 0.406: v108.59,16.19 108.59,6.03 109.85,4.76 SZ.P$4
  Bottom 0.406: O10.P12 14.34,16.25 16.19,18.1 33.66,18.1 35.56,16.19 42.94,16.19 O1.P12 48.63,16.25 50.48,18.1 56.83,18.1 58.74,16.19 80.41,16.19 P10.P12 86.1,16.25 87.95,18.1 102.55,18.1 104.46,16.19 v108.59,16.19 115.33,16.19 P1.P12 120.7,16.25 122.56,18.1 147.95,18.1 149.86,16.19 152.8,16.19 MP10.P12 152.91,16.19 158.75,16.19 160.66,18.1 177.48,18.1 179.33,16.25 MP1.P12
K3  (via drill 0.6)
  Top 0.406: v98.74,21.59 98.74,8.57 94.61,4.45 SZ.P$10
  Bottom 0.406: O10.P11 15.82,19.95 17.46,21.59 34.61,21.59 36.19,20 42.94,20 O1.P11 43.05,20 48.26,20 49.85,21.59 58.42,21.59 60.06,19.95 P10.P11 80.72,19.69 85.09,19.69 86.68,21.27 95.57,21.27 95.88,21.59 v98.74,21.59 104.46,21.59 106.1,19.95 P1.P11 115.65,19.69 120.33,19.69 122.24,21.59 149.86,21.59 151.5,19.95 MP10.P11 152.91,20 158.12,20 159.7,21.59 177.8,21.59 179.44,19.95 MP1.P11
K4  (via drill 0.6)
  Top 0.406: v113.03,23.29 113.03,9.21 117.47,4.76 SZ.P$1
  Bottom 0.406: O10.P10 20.11,23.29 24.13,27.3 40.59,27.3 O1.P10 | 44.4,23.49 O1.P10 | MP1.P10 180.87,23.29 176.85,27.3 168.91,27.3 165.42,23.81 157.48,23.81 156.84,23.18 154.57,23.18 MP10.P10 153.24,23.29 151.45,25.08 129.22,25.08 127.95,23.81 120.65,23.81 120.01,23.18 117.11,23.18 P1.P10 v113.03,23.29 108.47,23.29 107,24.77 93.98,24.77 93.03,23.81 85.09,23.81 84.45,23.18 82.18,23.18 P10.P10 81.96,23.18 62.23,23.18 60.32,25.08 56.83,25.08 55.56,23.81 48.26,23.81 47.73,23.29 O1.P10
K5  (via drill 0.6)
  Top 0.406: v184.15,6.35 184.15,21.27 188.59,25.72 192.17,25.72 MP1.P9 | MP10.P9 157.28,25.6 156.21,25.72 150.5,25.72 149.86,25.08 v149.86,6.35 | v111.44,25.08 111.44,7.94 114.94,4.45 SZ.P$2 | P10.P9 78.3,25.6 77.47,24.77 v77.47,6.35 | O1.P9 40.84,25.6 40,24.77 v40,6.35
  Bottom 0.406: O10.P9 12.58,27.11 12.06,27.62 6.35,27.62 5.4,26.67 5.4,6.99 6.03,6.35 v40,6.35 v77.47,6.35 114.94,6.03 | 114.94,6.03 v149.86,6.35 v184.15,6.35 | SZ.P$2 114.94,6.03 | P1.P9 111.96,25.6 v111.44,25.08
K6  (via drill 0.6)
  Top 0.406: v100.33,26.04 100.33,7.3 97.16,4.13 SZ.P$9
  Bottom 0.406: O10.P7 19.88,25.6 22.54,28.26 54.93,28.26 | 54.93,28.26 91.12,28.26 92.19,27.19 P10.P7 92.63,26.04 v100.33,26.04 110.17,26.04 112.39,28.26 126.37,28.26 127,27.62 | 164.47,28.26 198.75,28.26 199.39,27.62 199.39,25.71 MP1.P7 | MP10.P7 164.58,28.14 164.47,28.26 | O1.P7 54.73,28.06 54.93,28.26 | 127,27.62 127,25.71 P1.P7 127.12,27.51 127,27.62 | 127,27.62 158.12,27.62 158.75,28.26 164.47,28.26
K7  (via drill 0.6)
  Top 0.406: v102.23,23.29 102.23,6.99 99.69,4.45 SZ.P$8
  Bottom 0.406: O10.P6 35.45,23.29 37.15,21.59 48.26,21.59 49.21,22.54 56.88,22.54 O1.P6 | 57.52,23.18 O1.P6 | MP1.P6 196.33,23.29 194.63,21.59 180.02,21.59 178.44,23.18 167.59,23.18 MP10.P6 166.74,22.54 158.43,22.54 157.48,21.59 152.4,21.59 150.5,23.49 130.22,23.49 P1.P6 | 129.91,23.18 P1.P6 | O1.P6 57.74,23.18 59.37,23.18 60.96,21.59 84.77,21.59 85.72,22.54 93.98,22.54 94.72,23.29 P10.P6 v102.23,23.29 105.94,23.29 107.63,21.59 120.33,21.59 121.28,22.54 129.27,22.54 P1.P6
K8  (via drill 0.6)
  Top 0.406: v103.5,19.95 103.5,6.35 102.23,5.08 SZ.P$7
  Bottom 0.406: O10.P5 34.03,19.95 35.88,18.1 48.26,18.1 50.16,20 59.18,20 O1.P5 57.52,19.95 59.37,18.1 85.72,18.1 87.63,20 96.65,20 P10.P5 v103.5,19.95 103.88,19.95 105.73,18.1 120.65,18.1 122.56,20 131.57,20 P1.P5 131.68,20 148.91,20 150.81,18.1 158.75,18.1 160.6,19.95 MP10.P5 169.35,19.69 177.8,19.69 179.39,18.1 195.58,18.1 197.43,19.95 MP1.P5
K9  (via drill 0.6)
  Top 0.406: v109.85,14.6 109.85,6.67 112.39,4.13 SZ.P$3
  Bottom 0.406: O10.P4 33.6,16.25 35.24,14.6 49.21,14.6 50.8,16.19 59.18,16.19 O1.P4 56.46,16.25 58.1,14.6 86.36,14.6 87.95,16.19 96.65,16.19 P10.P4 96.76,16.19 101.92,16.19 103.5,14.6 v109.85,14.6 121.28,14.6 122.93,16.25 P1.P4 131.68,16.19 144.46,16.19 148.59,14.6 159.38,14.6 161.03,16.25 MP10.P4 169.15,16.19 177.16,16.19 178.75,14.6 195.58,14.6 197.22,16.25 MP1.P4
MP1
  Bottom 0.406: NIXI.P$1 120.65,45.72 121.6,44.77 121.6,43.5 122.56,42.54 128.59,42.54 129.22,43.18 U$2.P$34
MP10  (via drill 0.6)
  Top 0.406: v114.94,51.75 127.95,51.75 131.76,47.94 U$2.P$31
  Bottom 0.406: v114.94,51.75 NIXI.P$2
N$1
  Top 0.254: T15.1 129.21,56.18 129.86,56.83 T15.5
  Top 0.305: T15.5 U$1.13
N$2
  Bottom 0.406: S1.P$1 133.03,75.88 133.67,76.52 139.06,76.52 139.38,76.2 U$2.P$7
N$3
  Bottom 0.406: VFD.P$10 95.88,44.45 95.88,53.98 96.52,54.61 98.74,54.61 99.69,55.56 IC6.26
N$4
  Bottom 0.406: VFD.P$9 98.42,44.45 98.42,53.02 100.97,55.56 IC6.25
N$5
  Top 0.254: 86.75,62.05 87.4,62.05
N$6
  Top 0.254: U$3.SW 87.68,61.55
  Top 0.305: 87.68,61.55 88,61.55 88.27,61.28 88.27,59.69 87.95,59.37 84.77,59.37 84.45,59.06 84.45,55.71 L1.1
N$7
  Top 0.406: R1.1 OK1.2
N$8
  Bottom 0.406: VFD.P$8 100.97,44.45 100.97,53.34 102.23,54.61 IC6.24
N$9
  Top 0.254: 84.6,62.05 83.99,62.05
N$10
  Top 0.406: R2.1 OK2.2
N$11
  Top 0.406: R4.1 OK3.2
N$12
  Top 0.406: R7.1 OK6.2
N$13
  Bottom 0.406: OK6.1 27.62,31.43 27.94,31.12 33.97,31.12 34.92,30.16 80.96,30.16 82.55,31.75 DIG.P$10
N$14
  Bottom 0.406: DIG.P$3 109.85,33.97 110.49,34.61 135.57,34.61 136.53,33.65 OK3.1
N$15  (via drill 0.6)
  Top 0.406: OK1.4 181.93,27.94 181.61,28.26 173.04,28.26 | 173.04,28.26 138.11,28.26 | 68.26,28.26 34.92,28.26 | 34.92,28.26 28.26,28.26 27.62,27.62 OK6.4 | OK4.4 68.26,28.26 | OK3.4 138.11,28.26 | OK2.4 173.04,28.26 | OK5.4 34.92,28.26 | 68.26,28.26 v105.41,28.26 | v108.9,28.26 138.11,28.26
  Bottom 0.406: v105.41,28.26 v108.9,28.26
N$16
  Bottom 0.406: DIG.P$1 134.3,31.75 135.57,30.48 176.53,30.48 179.7,33.65 OK1.1
N$17
  Top 0.406: OK4.2 R5.1
N$18
  Bottom 0.406: R19.E 76.2,75.88 77.15,76.84 R20.1
N$19
  Bottom 0.406: OK4.1 68.26,32.7 68.58,32.38 73.66,32.38 76.52,35.24 101.28,35.24 102.23,34.29 DIG.P$8
N$20
  Bottom 0.406: R19.A 71.12,70.17 71.44,69.85 77.79,69.85 78.74,70.8 78.74,73.66 79.38,74.3 R21.2
N$21
  Top 0.406: R6.1 OK5.2
N$22
  Bottom 0.61: IC2.3 63.18,58.42 64.45,57.15 Q1.G
N$23
  Bottom 0.406: R17.1 R16.2 60.96,64.56 60.96,65.41 60.64,65.72 IC2.7
N$24
  Bottom 0.305: C12.1 60.32,62.86 60.64,62.55
  Bottom 0.406: IC2.6 63.18,64.87 R16.1 63.18,64.03 63.18,62.86 62.86,62.55 60.64,62.55 IC2.2
N$25
  Bottom 0.406: OK5.1 34.92,31.75 35.24,31.43 77.15,31.43 79.69,33.97 99.06,33.97 99.69,33.34 DIG.P$9
N$26
  Bottom 0.406: R18.2 IC2.5 67.31,67.63 67.63,67.95 T9.C
N$27
  Bottom 0.61: C10.1 73.98,50.17 R3.1
N$28
  Top 0.305: R37.1 147.1,68.48 S.P$1
  Bottom 0.406: U$2.P$1 148.91,74.93 149.22,74.61 149.22,69.21 148.59,68.58 S.P$1
N$29
  Bottom 0.406: DIG.P$2 112.39,33.02 113.03,33.65 134.62,33.65 136.53,31.75 169.86,31.75 171.77,33.65 OK2.1
N$30
  Top 0.406: R8.1 198.75,4.13 199.71,5.08 199.71,10.4 MP1.P2
N$31
  Top 0.406: R9.1 165.42,4.13 164.47,5.08 164.47,10.48 MP10.P2
N$32
  Top 0.406: P1.P2 127.12,4.33 R10.1
N$33
  Top 0.406: P10.P2 92.19,3.93 R11.1
N$34
  Top 0.406: R12.1 53.66,4.45 54.61,5.4 54.61,10.4 O1.P2
N$35
  Top 0.406: R13.1 20.32,4.45 19.68,5.08 19.68,10.48 O10.P2
N$36
  Top 0.406: R13.2 30.48,23.18 30.16,23.49 OK6.3
N$37
  Top 0.406: R12.2 33.34,22.22 33.66,22.54 37.15,22.54 37.46,22.86 OK5.3
N$38
  Top 0.406: OK4.3 70.8,4.45 71.44,3.81 R11.2
N$39
  Top 0.406: OK3.3 140.65,5.08 139.7,4.13 R10.2
N$40
  Top 0.406: R9.2 172.72,18.41 175.58,21.27 OK2.3
N$41
  Top 0.406: R8.2 180.66,14.29 181.61,15.24 181.61,20.64 184.47,23.49 OK1.3
N$44
  Top 0.61: L2.2 74.3,55.56 73.66,54.93 D1.A
  Bottom 0.61: Q1.D 61.91,52.71 62.23,52.39 R3.2 D1.A
N$46
  Bottom 0.406: U$2.P$23 DS18B20.P$2 144.46,51.65 R38.1
N$52
  Bottom 0.406: IC6.19 108.59,52.71 109.22,52.07 110.49,52.07 111.12,51.43 111.12,44.45 VFD.P$3
N$53
  Bottom 0.406: IC6.18 109.85,53.98 111.12,52.71 113.03,52.71 113.66,52.07 113.66,44.45 VFD.P$2
N$54  (via drill 0.6)
  Top 0.406: LED1.2-DOUT 193.55,10.67 v192.41,9.52 | v170.18,9.52 170.18,13.97 169.54,14.6 166.69,14.6 166.05,15.24 166.05,19.05 165.42,19.69 163.38,19.69 LED2.4-DIN
  Bottom 0.406: v192.41,9.52 v170.18,9.52
N$55  (via drill 0.6)
  Top 0.406: LED2.2-DOUT 158.62,10.98 v157.48,9.84 | v134.62,10.79 134.62,13.97 133.98,14.6 129.54,14.6 128.91,15.24 128.91,19.05 128.27,19.69 125.92,19.69 LED3.4-DIN
  Bottom 0.406: v157.48,9.84 135.57,9.84 v134.62,10.79
N$60
  Bottom 0.406: IC6.17 111.12,53.98 111.44,53.66 115.57,53.66 116.2,53.02 116.2,44.45 VFD.P$1
N$65  (via drill 0.6)
  Top 0.406: LED3.2-DOUT 121.16,10.98 v120.01,9.84 | v97.47,9.84 97.47,13.97 96.84,14.6 94.3,14.6 93.66,15.24 93.66,19.05 93.03,19.69 91,19.69 LED4.4-DIN
  Bottom 0.406: v120.01,9.84 v97.47,9.84
N$66  (via drill 0.6)
  Top 0.406: LED4.2-DOUT 86.23,10.67 v85.09,9.52 | v60.96,9.52 60.96,13.97 60.32,14.6 57.15,14.6 56.52,15.24 56.52,19.05 55.88,19.69 53.53,19.69 LED5.4-DIN
  Bottom 0.406: v85.09,9.52 v60.96,9.52
N$70
  Top 0.61: 64.35,50.17 X2.1
  Top 0.813: D2.A 64.35,50.17
N$71  (via drill 0.6)
  Top 0.406: v207.01,18.1 199.07,18.1 198.44,18.73 198.44,19.56 LED1.4-DIN
  Bottom 0.406: DIG.P$4 109.85,30.16 110.81,29.21 206.06,29.21 207.01,28.26 v207.01,18.1
N$72
  Top 0.305: U$2.P$2 149.12,72.39 R36.1
  Bottom 0.406: S.P$2 144.46,69.21 U$2.P$2
N$73
  Bottom 0.406: S1.P$2 130.49,76.84 131.13,77.47 140.34,77.47 140.65,77.15 140.65,73.66 U$2.P$8
N$74
  Top 0.406: X1.2 144.63,58.25 144.46,58.42 144.46,60.64 144.15,60.96 R39.1
N$75
  Top 0.406: R40.2 129.22,62.55 128.59,63.18 U$1.5
N$76
  Top 0.406: R39.2 139.7,60.96 139.06,61.6 127.95,61.6 127.32,62.23 U$1.6
N$77
  Top 0.406: X1.3 145.73,59.06 145.41,59.37 145.41,62.23 145.1,62.55 R40.1
N$78  (via drill 0.6)
  Top 0.406: LED5.2-DOUT 48.77,10.67 v47.62,9.52 | v25.4,10.48 25.4,13.97 24.76,14.6 22.22,14.6 21.59,15.24 21.59,19.05 20.95,19.69 18.6,19.69 LED6.4-DIN
  Bottom 0.406: v47.62,9.52 26.35,9.52 v25.4,10.48
N$79
  Top 0.254: T15.2 129.86,56.2 130.49,56.83 130.49,57.3 T15.4
  Top 0.305: T15.4 130.51,57.8 131.13,58.42 U$1.14
N$80
  Top 0.305: Q2.3 120.8,65.66 C20.2 121.07,65.72 121.92,65.72 122.72,64.92 U$1.8
N$81  (via drill 0.6)
  Top 0.406: C18.2 194.73,20.11 194.31,19.69 193.61,19.69 LED1.1-VDD 193.49,19.69 192.09,19.69 191.45,19.05 191.45,11.43 190.5,10.48 v190.5,7.62 | C13.2 15.02,20.11 14.6,19.69 13.9,19.69 | 13.9,19.69 LED6.1-VDD | C14.2 50.27,20.11 49.85,19.69 48.83,19.69 LED5.1-VDD 47.05,19.75 46.67,19.37 46.67,10.79 45.4,9.52 v45.4,7.62 | C15.2 87.73,20.11 87.31,19.69 86.3,19.69 | 121.22,19.69 122.24,19.69 122.66,20.11 C16.2 120.33,22.54 116.2,26.67 108.27,26.67 107.31,27.62 DIG.P$5 | 121.22,19.69 LED3.1-VDD | C17.2 159.81,20.11 159.38,19.69 158.69,19.69 LED2.1-VDD 157.22,19.75 156.53,19.05 156.53,11.75 154.62,9.84 v154.62,7.62 | 13.9,19.69 12.7,19.69 12.06,19.05 v12.06,7.62 | 121.22,19.69 120.01,19.69 119.38,19.05 119.38,12.06 117.16,9.84 v117.16,7.62 | 86.3,19.69 84.77,19.69 84.45,19.37 84.45,12.06 81.91,9.52 v81.91,7.62 | 86.3,19.69 LED4.1-VDD
  Top 0.61: GND-5V.P$2 DIG.P$5
  Bottom 0.406: v12.06,7.62 v45.4,7.62 v81.91,7.62 v117.16,7.62 v154.62,7.62 v190.5,7.62
N$89
  Top 0.305: U$1.7 126.05,61.6 125.73,61.28 122.55,61.28 Q2.1 | 122.56,60.98 Q2.1 | C21.1 122.77,60.76 Q2.1
N$92
  Top 0.406: U$2.P$22 RX/TX.P$2
N$93
  Top 0.406: U$2.P$24 RX/TX.P$3
N$94
  Bottom 0.305: T16.C 125.24,56.68 SG1.-
N$95  (via drill 0.6)
  Top 0.305: U$2.P$5 141.92,76.2 141.29,76.84 120.33,76.84 119.7,76.2 v119.7,55.56
  Bottom 0.305: v119.7,55.56 119.7,51.75 120.33,51.12 122.72,51.12 T16.B
N$96
  Top 0.305: J1.2 153.35,70.17 152.72,70.8 148.59,70.8 147.95,70.49 142.56,70.49 141.92,71.12 U$2.P$6
  Bottom 0.305: R43.1 152.5,70.7 J1.2
N$97
  Top 0.254: 86.77,61.05 87.38,61.05
N$98  (via drill 1)
  Top 0.406: R35.A 90.11,68.64 90.65,68.1 R25.1
  Bottom 0.406: R35.A 88.23,71.4 v88.27,71.44
N$99  (via drill 1)
  Top 0.254: U$3.FB 87.95,62.55 88.27,62.86
  Top 0.406: R35.E 85.35,68.64 85.72,68.26 85.72,66.13 R35.S 87.89,66.1 88.27,65.72 88.27,62.86
  Bottom 0.406: C1.2 85.84,65.94 R35.S | R26.2 82.91,68.87 R35.E 83.19,68.67 v83.19,71.44
N$119
  Bottom 0.406: T9.B 65.09,73.98 65.72,74.61 R19.S
P1
  Top 0.406: NIXI.P$3 113.66,44.45 113.66,41.59 113.98,41.28 121.6,41.28 123.19,42.86 131.44,42.86 131.76,43.18 U$2.P$32
P10  (via drill 0.6)
  Top 0.406: v99.69,52.71 128.91,52.71 134.3,47.31 U$2.P$29
  Bottom 0.406: v99.69,52.71 NIXI.P$8
PRG  (via drill 0.6)
  Top 0.254: v127.63,57.47 129.06,57.47 T15.6
  Top 0.406: U$2.P$33 129.22,48.58 v127.63,50.17
  Bottom 0.406: v127.63,50.17 v127.63,57.47
RGB
  Top 0.406: NIXI.P$4 109.85,47.31 110.17,47.63 123.19,47.63 124.14,46.67 124.14,45.09 124.78,44.45 U$2.P$36
  Bottom 0.61: NIXI.P$4 VFD.P$4
SCL
  Top 0.406: I2C.P$2 135.25,42.86 137.79,42.86 138.11,43.18 138.11,45.72 U$2.P$25
  Bottom 0.406: R41.1 U$2.P$25
SDA
  Bottom 0.406: I2C.P$3 132.72,42.86 135.25,42.86 U$2.P$28 138.11,45.72 138.11,48.26 137.48,48.89 R42.1
VBB  (via drill 0.6)
  Top 0.61: v92.07,48.26 104.14,48.26 104.78,47.63 NIXI.P$6
  Bottom 0.406: 85.72,67.31 85.72,76.2 86.36,76.84 R20.2
  Bottom 0.61: IC6.1 85.72,67.31 79.69,67.31 78.74,66.36 D1.C 78.74,48.58 79.18,48.13 85.41,48.13 | v92.07,48.26 91.95,48.13 85.41,48.13 | C7.+ 85.41,48.13
Ó1  (via drill 0.6)
  Top 0.406: v97.16,53.66 129.86,53.66 135.57,47.94 135.57,45.72 U$2.P$30
  Bottom 0.406: v97.16,53.66 NIXI.P$9
Ó10  (via drill 0.6)
  Top 0.406: v94.61,54.61 130.49,54.61 136.84,48.26 U$2.P$27
  Bottom 0.406: v94.61,54.61 NIXI.P$10

### Text on the board
Top: 1 | UNFI | Z560M+RGB
Bottom: UNFI | Z560M+RGB
tPlace: ESP-32 UNICLOCK | 5V DC | UNFI | UNFI | Z560M+RGB | 3 | 6 | 7 | 8 | 1 | 0 | 2 | 9 | 5 | 4 | ESP-32 UNICLOCK
bPlace: Z560M+RGB